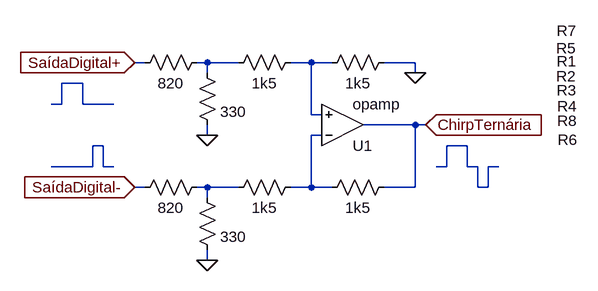
[diagram p0: schematic Draft1.asc]
Draft1.asc, the LTspice schematic file:
Version 4
SHEET 1 880 680
WIRE -48 48 -64 48
WIRE 48 48 32 48
WIRE 96 48 48 48
WIRE 208 48 176 48
WIRE 240 48 208 48
WIRE 368 48 320 48
WIRE 48 64 48 48
WIRE 368 64 368 48
WIRE -144 80 -176 80
WIRE -176 112 -176 80
WIRE -176 112 -192 112
WIRE -144 112 -144 80
WIRE -96 112 -144 112
WIRE 208 128 208 48
WIRE 224 128 208 128
WIRE 368 144 288 144
WIRE 384 144 368 144
WIRE 48 160 48 144
WIRE 224 160 208 160
WIRE -112 176 -128 176
WIRE 448 176 416 176
WIRE -128 208 -128 176
WIRE -128 208 -192 208
WIRE -112 208 -112 176
WIRE -96 208 -112 208
WIRE 416 208 416 176
WIRE 416 208 400 208
WIRE 448 208 448 176
WIRE 464 208 448 208
WIRE 496 208 480 208
WIRE -48 240 -64 240
WIRE 48 240 32 240
WIRE 96 240 48 240
WIRE 208 240 208 160
WIRE 208 240 176 240
WIRE 240 240 208 240
WIRE 368 240 368 144
WIRE 368 240 320 240
WIRE 464 240 464 208
WIRE 480 240 480 208
WIRE 480 240 464 240
WIRE 48 256 48 240
WIRE 48 352 48 336
FLAG 48 352 0
FLAG 48 160 0
FLAG -64 48 SaídaDigital+
IOPIN -64 48 In
FLAG -64 240 SaídaDigital-
IOPIN -64 240 In
FLAG 368 64 0
FLAG 384 144 ChirpTernária
IOPIN 384 144 In
SYMBOL Opamps\\opamp 256 208 M180
SYMATTR InstName U1
SYMBOL res 192 32 R90
WINDOW 0 30 -409 VBottom 2
WINDOW 3 32 56 VTop 2
SYMATTR InstName R1
SYMATTR Value 1k5
SYMBOL res 336 32 R90
WINDOW 0 53 -264 VBottom 2
WINDOW 3 32 56 VTop 2
SYMATTR InstName R2
SYMATTR Value 1k5
SYMBOL res 336 224 R90
WINDOW 0 -118 -265 VBottom 2
WINDOW 3 32 56 VTop 2
SYMATTR InstName R3
SYMATTR Value 1k5
SYMBOL res 192 224 R90
WINDOW 0 -93 -410 VBottom 2
WINDOW 3 32 56 VTop 2
SYMATTR InstName R4
SYMATTR Value 1k5
SYMBOL res 32 48 R0
WINDOW 0 553 -22 Left 2
SYMATTR InstName R5
SYMATTR Value 330
SYMBOL res 32 240 R0
WINDOW 0 555 -73 Left 2
SYMATTR InstName R6
SYMATTR Value 330
SYMBOL res 48 32 R90
WINDOW 0 -17 -553 VBottom 2
WINDOW 3 32 56 VTop 2
SYMATTR InstName R7
SYMATTR Value 820
SYMBOL res 48 224 R90
WINDOW 0 -71 -554 VBottom 2
WINDOW 3 32 56 VTop 2
SYMATTR InstName R8
SYMATTR Value 820

The netlist it stands for:
* Draft1.asc
XU1 N004 N002 ChirpTernária opamp Aol=100K GBW=10Meg  ; pins invin noninvin out
R1 N002 N001 1k5
R2 0 N002 1k5
R3 ChirpTernária N004 1k5
R4 N004 N007 1k5
R5 N001 0 330
R6 N007 0 330
R7 N001 SaídaDigital+ 820
R8 N007 SaídaDigital- 820
.backanno
.end